# Altium project PCB_PIC16_SERVO_DS1307_STEP.PrjPcb
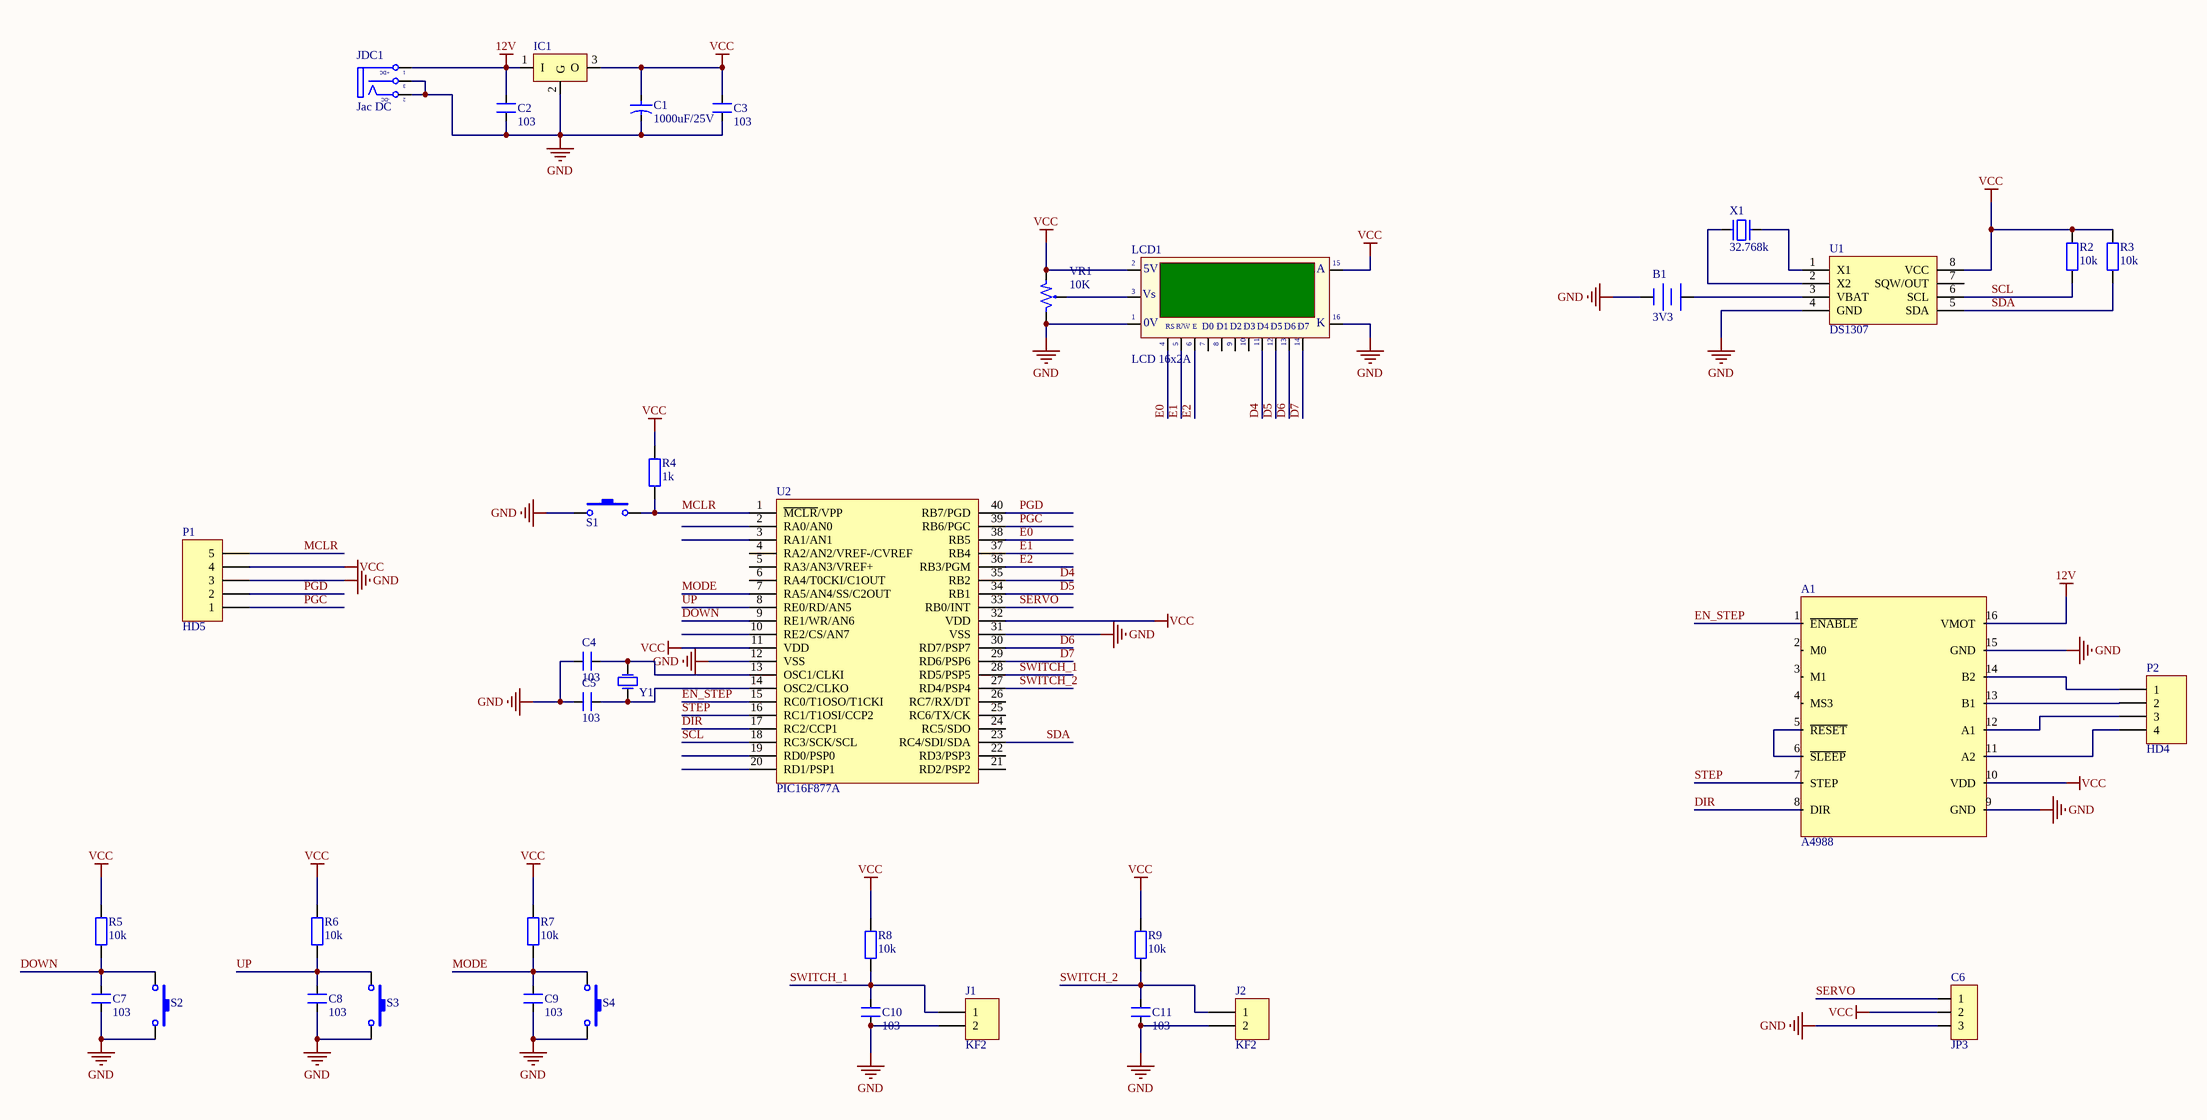
[diagram p0: PIC16_SERVO_DS1307_STEP.SchDoc]
1 sheet, 37 parts. Net scope: global (net labels, ports and power ports of the same name join across sheets).
Board file: PIC16_SERVO_DS1307_STEP.PcbDoc

## Sheet PIC16_SERVO_DS1307_STEP.SchDoc
size A0

### Parts
A1  A4988  [A4988]
B1  3V3  [PIN_CMOS]
C1  1000uF/25V  [CAP 1000uF/25V]
C2  103  [SM-0805]
C3  103  [SM-0805]
C4  103  [SM-0805]
C5  103  [SM-0805]
C6  JP3  [JP3-D1T]
C7  103  [SM-0805]
C8  103  [SM-0805]
C9  103  [SM-0805]
C10  103  [SM-0805]
C11  103  [SM-0805]
IC1  LM78xx  [TO252-123]  (value not drawn)
J1  KF2  [KF2-5.08]
J2  KF2  [KF2-5.08]
JDC1  Jac DC  [DC0]
LCD1  LCD 16x2A  [LCD16X2]
P1  HD5  [JUMP 5]
P2  HD4  [HEADER 4]
R2  10k  [RES-1/4W]
R3  10k  [RES-1/4W]
R4  1k  [R1/4W]
R5  10k  [RES-1/4W]
R6  10k  [RES-1/4W]
R7  10k  [RES-1/4W]
R8  10k  [RES-1/4W]
R9  10k  [RES-1/4W]
S1  SW  [BUTTON  ROUND]  (value not drawn)
S2  SW  [BUTTON  ROUND]  (value not drawn)
S3  SW  [BUTTON  ROUND]  (value not drawn)
S4  SW  [BUTTON  ROUND]  (value not drawn)
U1  DS1307  [DIP 8]
U2  PIC16F877A  [DIP 40]
VR1  10K  [VR]
X1  32.768k  [XT32k]
Y1  XTAL  [XTAL]  (value not drawn)

### Nets
12V: A1.16(VMOT) C2.1 IC1.1(I) JDC1.1(T)
GND: A1.9(GND) A1.15(GND) B1.2(-) C1.2 C2.2 C3.2 C4.2 C5.2 C6.3 C7.2 C8.2 C9.2 C10.2 C11.2 IC1.2(G) J1.2 J2.2 JDC1.2(TN) JDC1.3(S) LCD1.1(GND) LCD1.16(K) P1.3 S1.1 S2.2 S3.2 S4.2 U1.4(GND) U2.12(VSS) U2.31(VSS) VR1.3
VCC: A1.10(VDD) C1.1 C3.1 C6.2 IC1.3(O) LCD1.2(VDD) LCD1.15(A) P1.4 R2.2 R3.2 R4.1 R5.2 R6.2 R7.2 R8.2 R9.2 U1.8(VCC) U2.11(VDD) U2.32(VDD) VR1.1
D4: LCD1.11(D4) U2.35(RB2)
D5: LCD1.12(D5) U2.34(RB1)
D6: LCD1.13(D6) U2.30(RD7/PSP7)
D7: LCD1.14(D7) U2.29(RD6/PSP6)
DIR: A1.8(DIR) U2.17(RC2/CCP1)
DOWN: C7.1 R5.1 S2.1 U2.9(RE1/WR/AN6)
E0: LCD1.4(RS) U2.38(RB5)
E1: LCD1.5(R/~{W}) U2.37(RB4)
E2: LCD1.6(~{EN}) U2.36(RB3/PGM)
EN_STEP: A1.1(~{ENABLE}) U2.15(RC0/T1OSO/T1CKI)
MCLR: P1.5 R4.2 S1.2 U2.1(~{MCLR}/VPP)
MODE: C9.1 R7.1 S4.1 U2.7(RA5/AN4/SS/C2OUT)
PGC: P1.1 U2.39(RB6/PGC)
PGD: P1.2 U2.40(RB7/PGD)
SCL: R2.1 U1.6(SCL) U2.18(RC3/SCK/SCL)
SDA: R3.1 U1.5(SDA) U2.23(RC4/SDI/SDA)
SERVO: C6.1 U2.33(RB0/INT)
STEP: A1.7(STEP)
SWITCH_1: C10.1 J1.1 R8.1 U2.28(RD5/PSP5)
SWITCH_2: C11.1 J2.1 R9.1 U2.27(RD4/PSP4)
UP: C8.1 R6.1 S3.1 U2.8(RE0/RD/AN5)
NetA1_5: A1.5(~{RESET}) A1.6(~{SLEEP})
NetA1_11: A1.11(A2) P2.4
NetA1_12: A1.12(A1) P2.3
NetA1_13: A1.13(B1) P2.2
NetA1_14: A1.14(B2) P2.1
NetB1_1: B1.1(+) U1.3(VBAT)
NetC4_1: C4.1 U2.13(OSC1/CLKI) Y1.1(OSC1)
NetC5_1: C5.1 U2.14(OSC2/CLKO) Y1.2(OSC2)
NetLCD1_3: LCD1.3(VEE) VR1.2
NetU1_1: U1.1(X1) X1.2
NetU1_2: U1.2(X2) X1.1

Not connected (* = marked no-connect by the designer): A1 2(M0) 3(M1) 4(MS3); LCD1 7(D0) 8(D1) 9(D2) 10(D3); U1 7(SQW/OUT); U2 2(RA0/AN0) 3(RA1/AN1) 4(RA2/AN2/VREF-/CVREF) 5(RA3/AN3/VREF+) 6(RA4/T0CKI/C1OUT) 10(RE2/CS/AN7) 16(RC1/T1OSI/CCP2) 19(RD0/PSP0) 20(RD1/PSP1) 21(RD2/PSP2) 22(RD3/PSP3) 24(RC5/SDO) 25(RC6/TX/CK) 26(RC7/RX/DT)

### Notes on the sheet
- Labels drawn without touching a wire or pin: STEP
- (in symbol DCIN) +DC; -DC
- (in symbol LCD16x2A) 5V; Vs; |; 0V; R/W; E

### Library data of the parts
B1 = BAT
C1 = CAP 1000uF/25V
C2-C5 C7-C11 = CM: Cap SMD; Value: 103
C6 = JP3: WR-PHD 2.54 mm Angled Socket Header; Manufacturer: W¨¹rth Elektronik eiSos GmbH; partNo: 613003143121; ComponentLink1 Description: Manufacturer; ComponentLink2 Description: Datasheet; NoPins: 03; Created Date: 29 March 2013; ComponentLink1URL: http://www.we-online.com; ComponentLink2URL: http://katalog.we-online.de/em/datasheet/6130xx143121.pdf; Created by: Karrer Zheng
IC1 = LM78xx: Positive Voltage Regulator; Note: Tab is connected to pin 3 (GND).; Published: 24-Aug-2001; LatestRevisionDate: 17-Jul-2002; LatestRevisionNote: Re-released for DXP Platform.; DatasheetVersion: Apr-1994; PackageVersion: Jul-1998; PackageReference: ISOWATT220AB; Publisher: Altium Limited; PackageDescription: TO, Thru-Hole, Vertical, Heatsink Mounted; 3 In-Line Leads; Pitch 2.54 mm; Pin sequence 1, 3, 2; ComponentLink1Description: Manufacturer Link; ComponentLink1URL: http://www.st.com/; ComponentLink2Description: Datasheet; ComponentLink2URL: http://www.st.com/stonline/products/literature/ds/2146/l78m05c.pdf
J1 J2 = KF2: Manufacturer: Würth Elektronik eiSos GmbH; partNo: 691103110002; ComponentLink1 Description: Manufacturer; ComponentLink2 Description: Datasheet; NoPins: 2; Created Date: 29 October 2013; ComponentLink1URL: http://www.we-online.com; ComponentLink2URL: http://katalog.we-online.de/em/datasheet/6911031100xx.pdf; Created by: Karrer Zheng
JDC1 = DCIN: Jac DC input; Value: Jac DC
LCD1 = LCD16x2A: LCD dipslay 16 char, 2 line; Value: LCD16x2A
P1 = HEADER 5
P2 = HEADER 4
R2 R3 R5-R9 = R: Resistor R1/4W
R4 = R1/4W: Resistor 1/4W; Value: R1/4W - 1K
S1-S4 = SW-Button: Switch-Button; Published: 24-Mar-1999; LatestRevisionDate: 17-Jul-2002; LatestRevisionNote: Re-released for DXP Platform.; PackageReference: SPST-2; Publisher: Altium Limited
VR1 = VR1: Var Resistor; Value: VR 10K
X1 = XT2: Crystal, 32.768 KHz, -40 to 85 degC, 3.2 x 1.5 x 0.9 mm SMD; Value: 4Mhz
Y1 = XTAL2